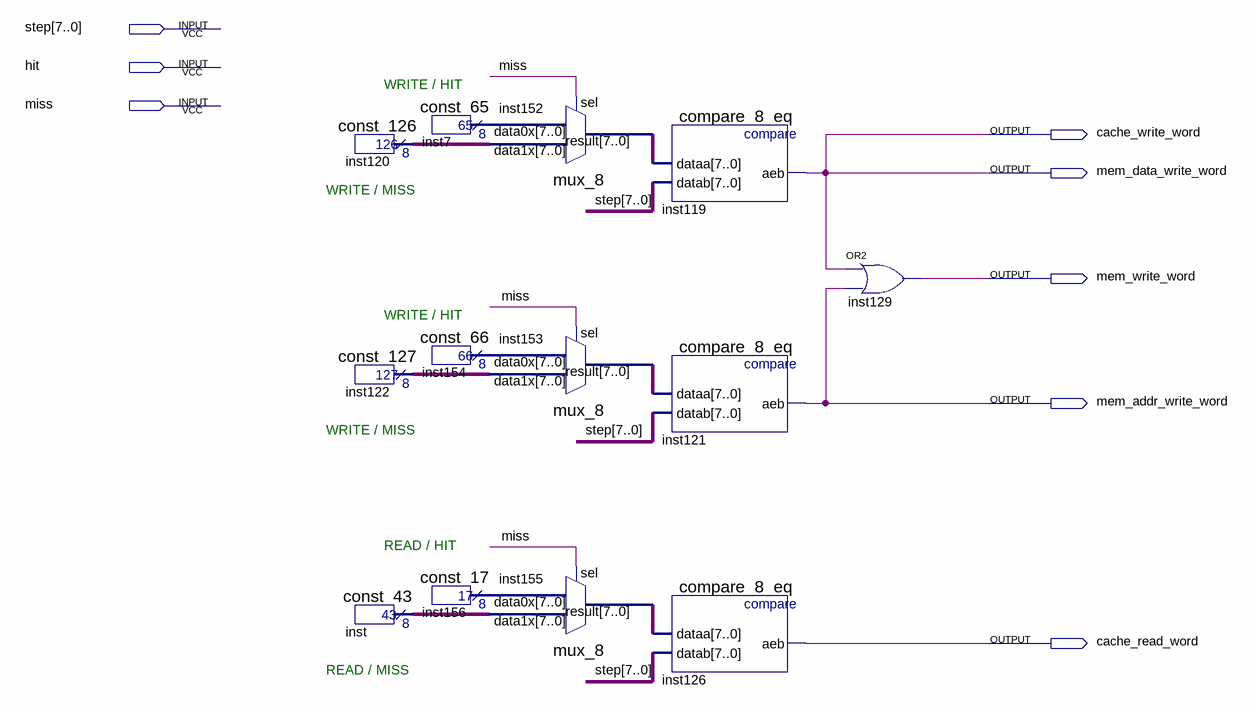
[diagram p0: schematic sheet]
// Quartus schematic other_enable_signals.bdf as structural Verilog: 13 symbols, 8 pins
module other_enable_signals (
  input  [7:0] step,
  input  hit,
  input  miss,
  output cache_write_word,
  output mem_data_write_word,
  output mem_write_word,
  output mem_addr_write_word,
  output cache_read_word
);

  wire [7:0] inst7_result, inst120_result, inst122_result, inst152_result, inst153_result, inst154_result,
       inst155_result, inst156_result, inst_result;

  const_126 inst120 (.result(inst120_result));
  const_127 inst122 (.result(inst122_result));
  const_43 inst (.result(inst_result));
  const_65 inst7 (.result(inst7_result));
  const_66 inst154 (.result(inst154_result));
  const_17 inst156 (.result(inst156_result));
  mux_8 inst152 (.data1x(inst120_result), .data0x(inst7_result), .sel(miss), .result(inst152_result));
  mux_8 inst153 (.data1x(inst122_result), .data0x(inst154_result), .sel(miss), .result(inst153_result));
  mux_8 inst155 (.data1x(inst_result), .data0x(inst156_result), .sel(miss), .result(inst155_result));
  compare_8_eq inst119 (.dataa(inst152_result), .datab(step), .aeb(cache_write_word));
  compare_8_eq inst121 (.dataa(inst153_result), .datab(step), .aeb(mem_addr_write_word));
  compare_8_eq inst126 (.dataa(inst155_result), .datab(step), .aeb(cache_read_word));
  or inst129 (mem_write_word, cache_write_word, mem_addr_write_word);

  assign mem_data_write_word = cache_write_word;

  // Notes on the sheet:
  //   WRITE / HIT
  //   WRITE / MISS
  //   WRITE / HIT
  //   WRITE / MISS
  //   READ / HIT
  //   READ / MISS
endmodule
